# EAGLE schematic voltage_selector_and_output (EAGLE 6.1)
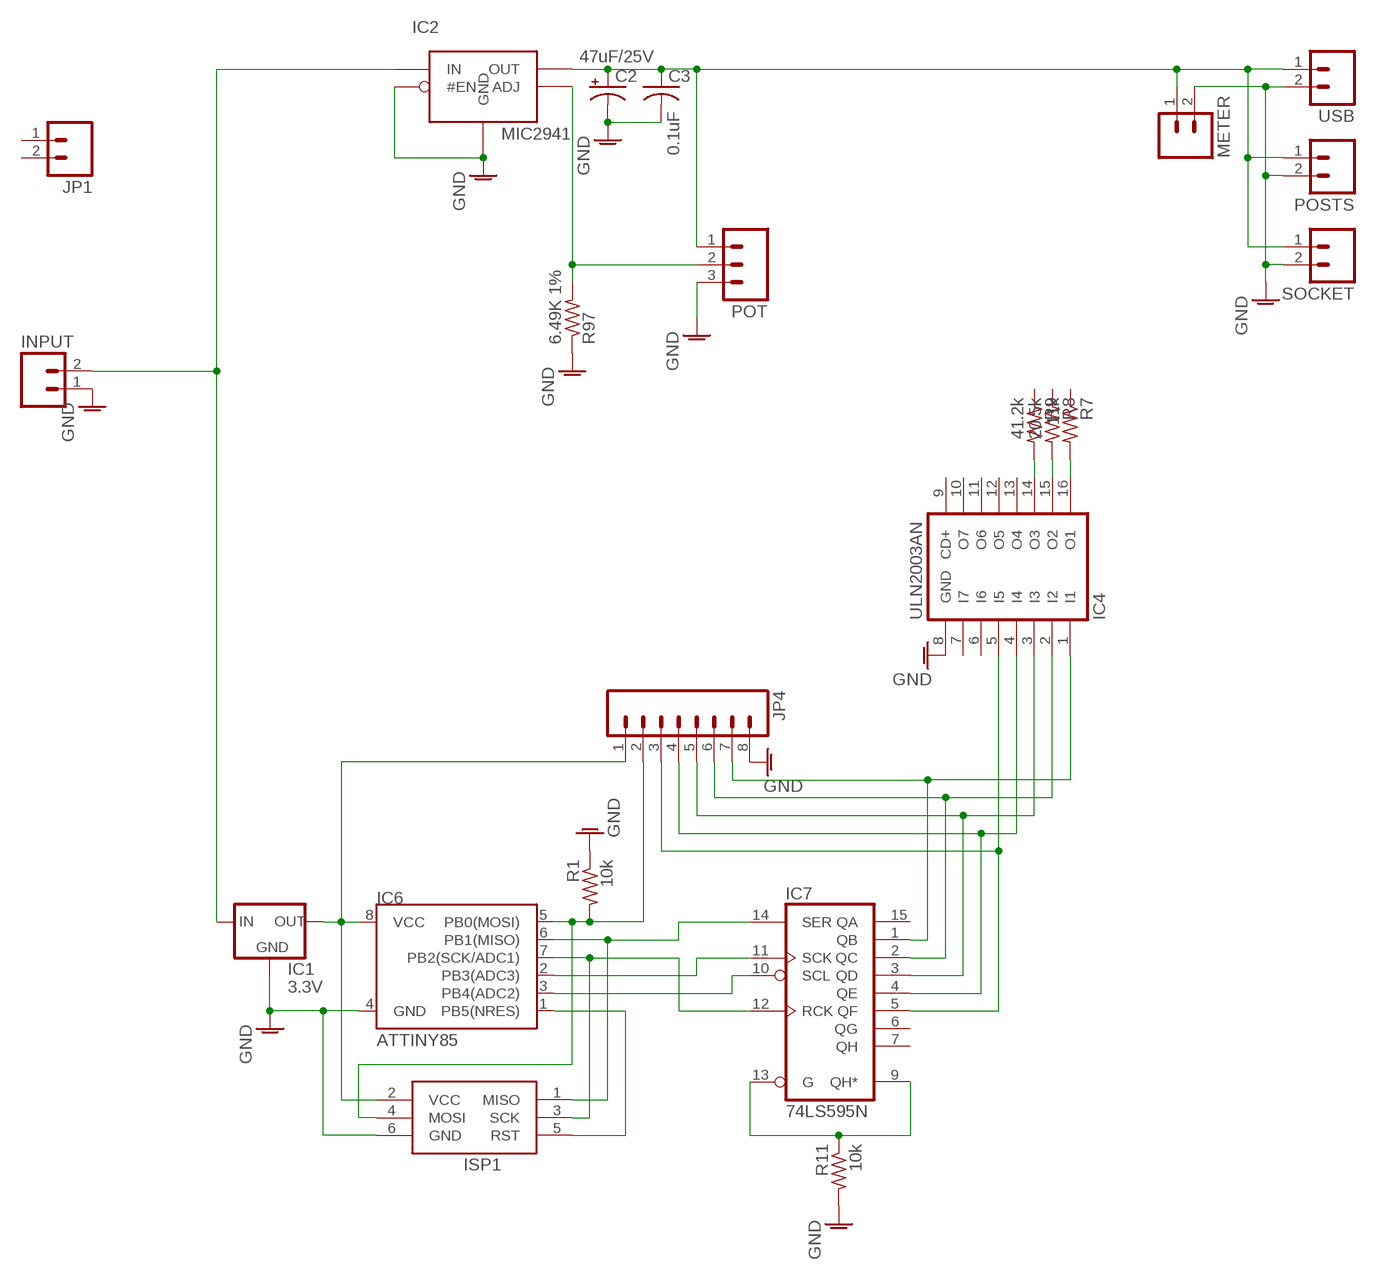
[diagram p0: schematic, sheet 1]

## Parts
C2  47uF/25V  CPOL-USE2.5-6  [E2,5-6]
C3  0.1uF  C-US025-025X050  [C025-025X050]
IC1  3.3V  78XXS  [78XXS]
IC2  MIC2941  [TO220-5]
IC4  ULN2003AN  [DIL16]
IC6  ATTINY85  ATTINY13DIP  [DIP08]
IC7  74LS595N  [DIL16]
INPUT  M02PTH  [1X02]
ISP1  AVRISP-6  [AVRISP]
JP1  M02JST-PTH-2  [JST-2-PTH]
JP4  M081X08  [1X08]
METER  M02PTH  [1X02]
POSTS  M02PTH  [1X02]
POT  M03PTH  [1X03]
R1  10k  R-US_0207/5V  [0207/5V]
R7  11k  R-US_0207/5V  [0207/5V]
R8  20.5k  R-US_0207/5V  [0207/5V]
R9  41.2k  R-US_0207/5V  [0207/5V]
R11  10k  R-US_0207/5V  [0207/5V]
R97  6.49K 1%  R-US_0207/5V  [0207/5V]
SOCKET  M02PTH  [1X02]
USB  M02PTH  [1X02]

## Nets
AGND: C2.- C3.2 IC1.GND IC2.2(#EN) IC2.3(GND) IC4.8(GND) IC6.4(GND) INPUT.1 ISP1.6(GND) JP4.8 METER.2 POSTS.2 POT.3 R1.1 R11.2 R97.1 SOCKET.2 USB.2 ; supply symbol labelled GND
ISP_VCC: IC1.OUT IC6.8(VCC) ISP1.2(VCC) JP4.1
N$1: IC1.IN IC2.4(IN) INPUT.2
N$8: IC2.1(ADJ) POT.2 R97.2
N$15: IC6.1(PB5(NRES)) ISP1.5(RST)
N$16: IC6.2(PB3(ADC3)) IC7.11(SCK)
N$17: IC6.3(PB4(ADC2)) IC7.10(SCL)
N$18: IC6.7(PB2(SCK/ADC1)) IC7.12(RCK) ISP1.3(SCK)
N$19: IC6.5(PB0(MOSI)) ISP1.4(MOSI) JP4.2 R1.2
N$22: IC4.16(O1) R7.2
N$23: IC6.6(PB1(MISO)) IC7.14(SER) ISP1.1(MISO)
N$24: IC4.15(O2) R8.2
N$25: IC4.14(O3) R9.2
N$27: IC4.1(I1) IC7.1(QB) JP4.7
N$28: IC4.2(I2) IC7.2(QC) JP4.6
N$29: IC4.3(I3) IC7.3(QD) JP4.5
N$30: IC4.4(I4) IC7.4(QE) JP4.4
N$31: IC4.5(I5) IC7.5(QF) JP4.3
N$34: IC7.9(QH*) IC7.13(G) R11.1
VADJ: C2.+ C3.1 IC2.5(OUT) METER.1 POSTS.1 POT.1 SOCKET.1 USB.1
Unconnected: IC4.6(I6) IC4.7(I7) IC4.9(CD+) IC4.10(O7) IC4.11(O6) IC4.12(O5) IC4.13(O4) IC7.6(QG) IC7.7(QH) IC7.15(QA) JP1.1 JP1.2 R7.1 R8.1 R9.1

## Power pins joined to a net without a drawn wire
GND: IC7.8(GND)
VCC: IC7.16(VCC)

## Library data of the parts
C2 = minimidi:CPOL-US: POLARIZED CAPACITOR, American symbol
C3 = minimidi:C-US: CAPACITOR, American symbol
IC1 = v-reg:78XXS: VOLTAGE REGULATOR
IC2 = bbsup:MIC2941
IC4 = uln-udn:ULN2003A: DRIVER ARRAY
IC6 = SparkFun:ATTINY13
IC7 = 74xx-us:74*595: 8-bit SHIFT REGISTER, output latch
INPUT JP1 METER POSTS SOCKET USB = SparkFun:M02: Header 2 Standard 2-pin 0.1" header. Use with straight break away headers (SKU : PRT-00116), right angle break away headers (PRT-00553), swiss pins (PRT-00743), machine pins (PRT-00117), and female headers (PRT-00115). Molex polarized connector foot print use with SKU : PRT-08233 with associated crimp pins and housings.
ISP1 = adafruit:AVRISP: AVR ISP HEADER Standard 6 pin header for AVR programming
JP4 = SparkFun:M08: Header 8 Standard 8-pin 0.1" header. Use with straight break away headers (SKU : PRT-00116), right angle break away headers (PRT-00553), swiss pins (PRT-00743), machine pins (PRT-00117), and female headers (PRT-00115).
POT = SparkFun:M03: Header 3 Standard 3-pin 0.1" header. Use with straight break away headers (SKU : PRT-00116), right angle break away headers (PRT-00553), swiss pins (PRT-00743), machine pins (PRT-00117), and female headers (PRT-00115). Molex polarized connector foot print use with SKU : PRT-08232 with associated crimp pins and housings.
R1 R7-R9 R11 R97 = rcl-ez:R-US_: RESISTOR, American symbol

## Net classes
1 power: width 0.61 mm